# Altium schematic sheet MIXR Regulators - Regulators.SchDoc: Title
size B; Organization: Midnight Sun Solar Rayce Car Team; Address1: University of Waterloo; Address2: 200 University Ave W; Address3: Waterloo, ON, Canada; Address4: N2L 3E9; Website: www.uwmidsun.com; ProjectName: ProjectName
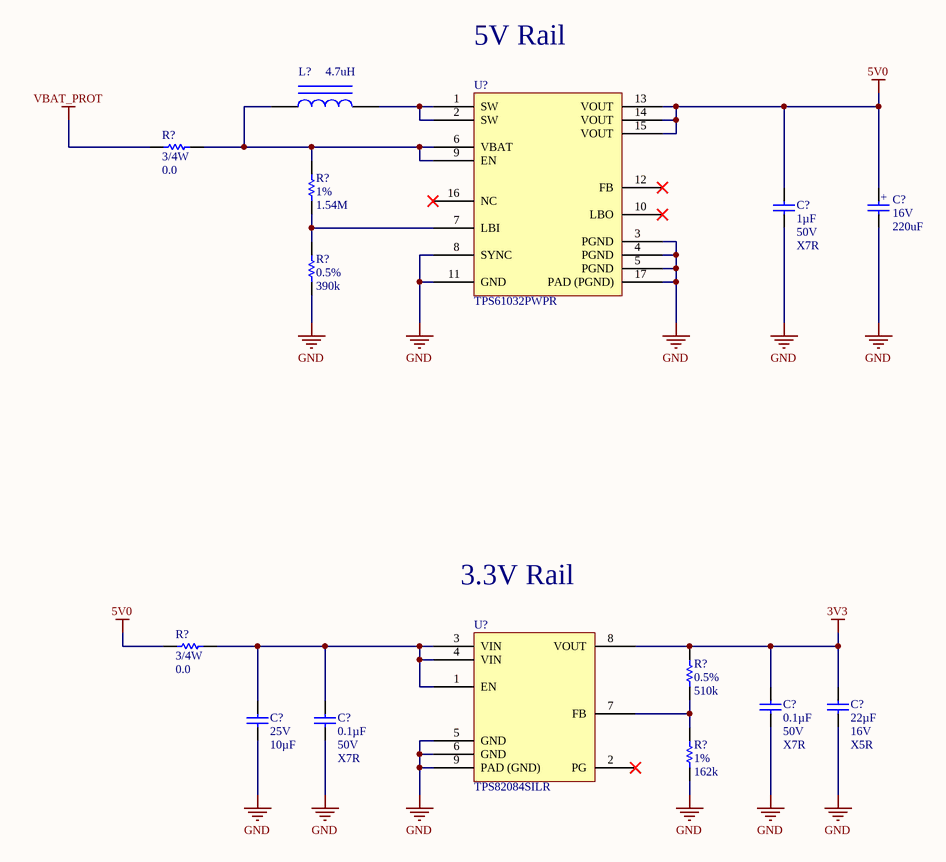
[diagram p0: MIXR Regulators - Regulators.SchDoc]

## Parts
(Parts that share a designator on the sheet are numbered #1, #2 ... from top to bottom, then left to right.)
C?#1  Capacitance: 1µF  Voltage: 50V  Temperature Coefficient: X7R  [CAP, 0603]  (hidden comment: CAP CER 1UF 50V 10% X7R 0603)
C?#2  Voltage: 16V  Capacitance: 220uF  [CAP ALUM 6.3MM RADIAL SMD]  (hidden comment: CAP ALUM 220UF 20% 16V SMD)
C?#3  Capacitance: 0.1µF  Voltage: 50V  Temperature Coefficient: X7R  [CAP, 0603]  (hidden comment: CAP CER 0.1UF 50V 10% X7R 0603)
C?#4  Capacitance: 22µF  Voltage: 16V  Temperature Coefficient: X5R  [CAP, 1210]  (hidden comment: CAP CER 22UF 16V ±20% X5R 1210)
C?#5  Voltage - Rated: 25V  Capacitance: 10µF  [CAP, 0805]  (hidden comment: CAP CER 10uF 25V 10% X5R 0805)
C?#6  Capacitance: 0.1µF  Voltage: 50V  Temperature Coefficient: X7R  [CAP, 0603]  (hidden comment: CAP CER 0.1UF 50V 10% X7R 0603)
L?  Inductance: 4.7uH  [IND 4.7uH 9.4A 10% SMD]  (hidden comment: IND 4.7uH 9.4A 10% SMD)
R?#1  Power (Watts): 3/4W  Resistance: 0.0  [RES 1206]  (hidden comment: RES 0.0 OHM 3/4W 1206)
R?#2  Tolerance: 1%  Resistance: 1.54M  [RES, 0603]  (hidden comment: RES 1.54M OHM 1% 1/10W 0603)
R?#3  Tolerance: 0.5%  Resistance: 390k  [RES, 0603]  (hidden comment: RES 390K OHM 1% 1/10W 0603)
R?#4  Power (Watts): 3/4W  Resistance: 0.0  [RES 1206]  (hidden comment: RES 0.0 OHM 3/4W 1206)
R?#5  Tolerance: 0.5%  Resistance: 510k  [RES, 0603]  (hidden comment: RES 510K OHM 0.5% 1/10W 0603)
R?#6  Tolerance: 1%  Resistance: 162k  [RES, 0603]  (hidden comment: RES 162K OHM 1% 1/10W 0603)
U?#1  Manufacturer Part Number: TPS61032PWPR  [IC REG BOOST 5V 3.6A 16-TSSOP]  (hidden comment: IC REG BOOST 5V 3.6A 16-TSSOP)
U?#2  Manufacturer Part Number: TPS82084SILR  [IC DCDC 0.8-6V 2A 8-uSIP]  (hidden comment: IC DCDC 0.8-6V 2A 8-uSIP)

## Nets
3V3: C?#3.1 C?#4.1 R?#5.1 U?#2.8(VOUT)
5V0: C?#1.1 C?#2.1 R?#4.1 U?#1.13(VOUT) U?#1.14(VOUT) U?#1.15(VOUT)
GND: C?#1.2 C?#2.2 C?#3.2 C?#4.2 C?#5.2 C?#6.2 R?#3.2 R?#6.2 U?#1.3(PGND) U?#1.4(PGND) U?#1.5(PGND) U?#1.8(SYNC) U?#1.11(GND) U?#1.17(PAD_(PGND)) U?#2.5(GND) U?#2.6(GND) U?#2.9(PAD_(GND))
VBAT_PROT: R?#1.1
NetC?#5_1: C?#5.1 C?#6.1 R?#4.2 U?#2.1(EN) U?#2.3(VIN) U?#2.4(VIN)
NetL?_1: L?.1 R?#1.2 R?#2.1 U?#1.6(VBAT) U?#1.9(EN)
NetL?_2: L?.2 U?#1.1(SW) U?#1.2(SW)
NetR?#2_2: R?#2.2 R?#3.1 U?#1.7(LBI)
NetR?#5_2: R?#5.2 R?#6.1 U?#2.7(FB)

Not connected (* = marked no-connect by the designer): U?#1 10(LBO)* 12(FB)* 16(NC)*; U?#2 2(PG)*

## Notes on the sheet
- 5V Rail
- 3.3V Rail
- PROJECT
- DOCUMENT
- DRAWN BY
- LAST MODIFIED
- PART NUMBER
- REVISION
- SHEET
- VARIANT
- OF
- (in symbol CAP ALUM 220UF 20% 16V SMD) +

## Library data of the parts
C?#1 = CAP CER 1UF 50V 10% X7R 0603: 1µF ±10% 50V Ceramic Capacitor X7R 0603 (1608 Metric); Manufacturer 1: Taiyo Yuden; Manufacturer Part Number 1: UMK107AB7105KA-T; Supplier 1: Digi-Key; Supplier Part Number 1: 587-3247-1-ND; Packaging: Cut Tape (CT); Part Status: Active; Operating Temperature: -55°C ~ 125°C; Ratings: -; Mounting Type: Surface Mount, MLCC; Package / Case: 0603 (1608 Metric); Size / Dimension: 0.063" L x 0.031" W (1.60mm x 0.80mm); Height - Seated (Max): -; Thickness (Max): 0.037" (0.95mm); Lead Spacing: -; Lead Style: -; ComponentLink1URL: http://www.yuden.co.jp/productdata/catalog/en/mlcc_all_e.pdf; ComponentLink1Description: http://www.yuden.co.jp/productdata/catalog/en/mlcc_all_e.pdf; Tolerance: ±10%
C?#2 = CAP ALUM 220UF 20% 16V SMD: 220µF 16V Aluminum Electrolytic Capacitors Radial, Can - SMD 2000 Hrs @ 85°C /; Manufacturer: Panasonic; Manufacturer Part Number: EEE-1CA221XAP; Ripple Current: 162mA; Polarity: Polar; Leakage Current: 3uA; Life (Hours): 2000Hour; Dissipation Factor: 0.2%; Supplier 1: Digi-Key; Supplier Part Number 1: PCE4583CT-ND; Stock 1: 3321; Pricing 1: 1 = 0.46000, 10 = 0.32200, 100 = 0.21190 (USD); RoHS: Yes; Mount: Surface Mount; Case/Package: Radial; Number of Pins: 8; Contact Plating: Tin; Min Operating Temperature: -40°C; Max Operating Temperature: 85°C; Tolerance: 20%; Voltage Rating (DC): 16V; Voltage Rating: 16V; Packaging: Tape and Reel; Package Quantity: 900; Ripple Current (AC): 162mA; Termination: SMD/SMT; Diameter: 6.3mm; Length: 8mm; Height: 7.7mm; Height - Seated (Max): 0.303inch; Radiation Hardening: No; REACH SVHC: No SVHC; ComponentLink1URL: https://datasheet.ciiva.com/30258/aba0000ce115-30258470.pdf?src-supplier=Onlinecomponents.com; ComponentLink1Description: https://datasheet.ciiva.com/30258/aba0000ce115-30258470.pdf?src-supplier=Onlinecomponents.com; ComponentLink2URL: https://datasheet.ciiva.com/46378/1790637-46378313.pdf?src-supplier=Element14; ComponentLink2Description: https://datasheet.ciiva.com/46378/1790637-46378313.pdf?src-supplier=Element14; ComponentLink3URL: https://datasheet.ciiva.com/2985/aba0000ce115-2985082.pdf?src-supplier=Avnet; ComponentLink3Description: https://datasheet.ciiva.com/2985/aba0000ce115-2985082.pdf?src-supplier=Avnet; ComponentLink4URL: https://datasheet.ciiva.com/2985/aba0000ce115-2985083.pdf?src-supplier=Avnet; ComponentLink4Description: https://datasheet.ciiva.com/2985/aba0000ce115-2985083.pdf?src-supplier=Avnet; ComponentLink5URL: https://datasheet.ciiva.com/43470/1790637-43470636.pdf?src-supplier=Farnell; ComponentLink5Description: https://datasheet.ciiva.com/43470/1790637-43470636.pdf?src-supplier=Farnell; ComponentLink6URL: https://datasheet.ciiva.com/17530/aba0000ce115-17530127.pdf?src-supplier=Avnet+Europe; ComponentLink6Description: https://datasheet.ciiva.com/17530/aba0000ce115-17530127.pdf?src-supplier=Avnet+Europe; ComponentLink7URL: https://datasheet.ciiva.com/46374/1790637-46374335.pdf?src-supplier=Element14; ComponentLink7Description: https://datasheet.ciiva.com/46374/1790637-46374335.pdf?src-supplier=Element14
C?#3 C?#6 = CAP CER 0.1UF 50V 10% X7R 0603: 0.10µF ±10% 50V Ceramic Capacitor X7R 0603 (1608 Metric); Manufacturer 1: AVX Corporation; Manufacturer Part Number 1: 06035C104KAT2A; Supplier 1: Digi-Key; Supplier Part Number 1: 478-5052-1-ND; Packaging: Cut Tape (CT); Part Status: Active; Operating Temperature: -55°C ~ 125°C; Ratings: -; Mounting Type: Surface Mount, MLCC; Package / Case: 0603 (1608 Metric); Size / Dimension: 0.063" L x 0.032" W (1.60mm x 0.81mm); Height - Seated (Max): -; Thickness (Max): 0.035" (0.90mm); Lead Spacing: -; Lead Style: -; ComponentLink1URL: http://datasheets.avx.com/X7RDielectric.pdf; ComponentLink1Description: http://datasheets.avx.com/X7RDielectric.pdf; Tolerance: ±10%
C?#4 = CAP CER 22UF 16V ±20% X5R 1210: 22µF ±20% 16V Ceramic Capacitor X5R 1210 (3225 Metric); Manufacturer 1: Murata Electronics North America; Manufacturer Part Number 1: GRM32ER61C226ME20L; Supplier 1: Digi-Key; Supplier Part Number 1: 490-1881-1-ND; Packaging: Cut Tape (CT); Part Status: Active; Operating Temperature: -55°C ~ 85°C; Ratings: -; Mounting Type: Surface Mount, MLCC; Package / Case: 1210 (3225 Metric); Size / Dimension: 0.126" L x 0.098" W (3.20mm x 2.50mm); Height - Seated (Max): -; Thickness (Max): 0.106" (2.70mm); Lead Spacing: -; Lead Style: -; ComponentLink1URL: http://www.murata.com/~/media/webrenewal/support/library/catalog/products/capacitor/mlcc/c02e.ashx; ComponentLink1Description: http://www.murata.com/~/media/webrenewal/support/library/catalog/products/capacitor/mlcc/c02e.ashx; Tolerance: ±20%
C?#5 = CAP CER 10uF 25V 10% X5R 0805: 10µF ±10% 25V Ceramic Capacitor X5R 0805 (2012 Metric); Manufacturer: Murata Electronics North America; Manufacturer Part Number: GRM21BR61E106KA73L; Supplier 1: Digi-Key; RoHS: RoHS Compliant; Category: Capacitors; Stock 1: 1695157; Packaging: Cut Tape (CT); Part Status: Active; Tolerance: ±10%; Temperature Coefficient: X5R; Operating Temperature: -55°C ~ 85°C; Features: -; Ratings: -; Applications: General Purpose; Mounting Type: Surface Mount, MLCC; Package / Case: 0805 (2012 Metric); Size / Dimension: 0.079" L x 0.049" W (2.00mm x 1.25mm); Height - Seated (Max): -; Thickness (Max): 0.053" (1.35mm); Lead Spacing: -; Lead Style: -; ComponentLink1URL: http://search.murata.co.jp/Ceramy/image/img/A01X/G101/ENG/GRM21BR61E106KA73-01.pdf; ComponentLink1Description: http://search.murata.co.jp/Ceramy/image/img/A01X/G101/ENG/GRM21BR61E106KA73-01.pdf; Supplier Part Number 1: 490-5523-1-ND; Pricing 1: 1=0.3, 10=0.214, 100=0.1008, 500=0.07068, 1000=0.05851 (CAD)
L? = IND 4.7uH 9.4A 10% SMD: Fixed Inductors SER1360 High Current 4.7 uH 10 % 9.4 A; Manufacturer: Coilcraft; Manufacturer Part Number: SER1360-472KLB; Core Material: Ferrite; Self Resonant Frequency: 32MHz; Shielding: Shielded; DC Resistance (DCR): 6.05mR; Test Frequency: 100kHz; Supplier 1: Mouser; Supplier Part Number 1: 994-SER1360-472KLB; Stock 1: 2176; Pricing 1: 1 = 2.07000, 10 = 1.85000, 50 = 1.66000, 100 = 1.48000, 1000 = 1.07000, 10000 = 0.99800 (USD); RoHS: Yes; Min Operating Temperature: -40°C; Max Operating Temperature: 85°C; Packaging: Cut Tape; Tolerance: 10%; Termination: SMD/SMT; Length: 13mm; Height: 5.8mm; Width: 12.9mm; Lead Free: Contains Lead; ComponentLink1URL: http://www.mouser.com/ds/2/597/ser1360-270713.pdf?src-supplier=Mouser; ComponentLink1Description: http://www.mouser.com/ds/2/597/ser1360-270713.pdf?src-supplier=Mouser; Max DC Current: 9.4A
R?#1 R?#4 = RES 0.0 OHM 3/4W 1206: 0 Ohms Jumper 0.75W, 3/4W Chip Resistor 1206 (3216 Metric) Automotive AEC-Q200 Metal Foil; Manufacturer: Stackpole Electronics Inc.; Manufacturer Part Number: HCJ1206ZT0R00; Supplier 1: Digi-Key; RoHS: RoHS Compliant; Category: Resistors; Stock 1: 1029426; Pricing 1: 1=0.82, 10=0.583, 25=0.4552, 50=0.3852, 100=0.3034, 250=0.25676, 500=0.21006, 1000=0.16337 (CAD); Packaging: Cut Tape (CT); Part Status: Active; Tolerance: Jumper; Composition: Metal Foil; Features: Automotive AEC-Q200; Temperature Coefficient: -; Operating Temperature: -55°C ~ 155°C; Package / Case: 1206 (3216 Metric); Supplier Device Package: 1206; Size / Dimension: 0.122" L x 0.061" W (3.10mm x 1.55mm); Height - Seated (Max): 0.032" (0.80mm); Failure Rate: -; ComponentLink1URL: https://www.seielect.com/catalog/SEI-HCJ.pdf; ComponentLink1Description: https://www.seielect.com/catalog/SEI-HCJ.pdf; Supplier Part Number 1: HCJ1206ZT0R00CT-ND
R?#2 = RES 1.54M OHM 1% 1/10W 0603: Manufacturer: Vishay; Manufacturer Part Number: CRCW06031M54FKEA; Power Rating: 100mW; Voltage Rating: 75V; Temperature Coefficient: 100ppm/°C; Supplier 1: Digi-Key; Supplier Part Number 1: 541-1.54MHCT-ND; Stock 1: 7311; Pricing 1: 1 = 0.10000, 10 = 0.04000, 100 = 0.01620, 1000 = 0.00729, 2500 = 0.00633 (USD); RoHS: Yes; Case/Package: 0603; Number of Pins: 2; Weight: 7.1E-05oz; Case Code (Imperial): 0603; Case Code (Metric): 1608; Contact Plating: Tin; Min Operating Temperature: -55°C; Max Operating Temperature: 155°C; Packaging: Tape and Reel; Package Quantity: 10; Termination: SMD/SMT; Composition: Thick Film; Number of Terminations: 2; Military Standard: Not; Max Power Dissipation: 100mW; Features: Automotive AEC-Q200; Length: 1.55mm; Height: 0.02inch; Width: 0.85mm; Depth: 0.85mm; Radiation Hardening: No; REACH SVHC: Unknown; Lead Free: Lead Free; ComponentLink1URL: https://datasheet.ciiva.com/7670/1697337-7670550.pdf?src-supplier=Element14; ComponentLink1Description: https://datasheet.ciiva.com/7670/1697337-7670550.pdf?src-supplier=Element14; ComponentLink2URL: https://datasheet.ciiva.com/7670/1697337-7670551.pdf?src-supplier=Element14; ComponentLink2Description: https://datasheet.ciiva.com/7670/1697337-7670551.pdf?src-supplier=Element14; ComponentLink3URL: https://datasheet.ciiva.com/5585/dcrcwe3-109170-5585144.pdf?src-supplier=Mouser; ComponentLink3Description: https://datasheet.ciiva.com/5585/dcrcwe3-109170-5585144.pdf?src-supplier=Mouser; ComponentLink4URL: https://datasheet.ciiva.com/22676/1700796-22676058.pdf?src-supplier=Element14; ComponentLink4Description: https://datasheet.ciiva.com/22676/1700796-22676058.pdf?src-supplier=Element14; ComponentLink5URL: https://datasheet.ciiva.com/22676/1847332-22676059.pdf?src-supplier=Element14; ComponentLink5Description: https://datasheet.ciiva.com/22676/1847332-22676059.pdf?src-supplier=Element14; ComponentLink6URL: https://datasheet.ciiva.com/2513/dcrcwe3-2513692.pdf?src-supplier=Digi-Key; ComponentLink6Description: https://datasheet.ciiva.com/2513/dcrcwe3-2513692.pdf?src-supplier=Digi-Key; ComponentLink7URL: https://datasheet.ciiva.com/2513/dcrcwe3-2513693.pdf?src-supplier=Digi-Key; ComponentLink7Description: https://datasheet.ciiva.com/2513/dcrcwe3-2513693.pdf?src-supplier=Digi-Key; ComponentLink8URL: https://datasheet.ciiva.com/2513/dcrcwe3-2513694.pdf?src-supplier=Digi-Key; ComponentLink8Description: https://datasheet.ciiva.com/2513/dcrcwe3-2513694.pdf?src-supplier=Digi-Key; Voltage Rating (DC): 75V
R?#3 = RES 390K OHM 1% 1/10W 0603: 390 kOhms ±0.5% 0.1W, 1/10W Chip Resistor 0603 (1608 Metric) Thin Film /; Manufacturer: Yageo; Manufacturer Part Number: RT0603DRE07390KL; Max Power Dissipation: 100mW; Temperature Coefficient: 50ppm/°C; Supplier 1: Digi-Key; Supplier Part Number 1: 311-2555-1-ND; Stock 1: 4470; Pricing 1: 1 = 0.13000, 10 = 0.11900, 100 = 0.04580, 1000 = 0.02014, 2500 = 0.01740 (USD); RoHS: Yes; Case/Package: 0603; Case Code (Metric): 1608; Case Code (Imperial): 0603; Min Operating Temperature: -55°C; Max Operating Temperature: 155°C; Packaging: Tape and Reel; Composition: Thin Film; Number of Terminations: 2; Features: Moisture Resistant; Length: 0.063inch; Height: 0.022inch; Width: 0.031inch; ComponentLink1URL: http://www.yageo.com/documents/recent/PYu-RT_1-to-0.01_RoHS_L_9.pdf?src-supplier=Digi-Key; ComponentLink1Description: http://www.yageo.com/documents/recent/PYu-RT_1-to-0.01_RoHS_L_9.pdf?src-supplier=Digi-Key
R?#5 = RES 510K OHM 0.5% 1/10W 0603: 510 kOhms ±0.5% 0.1W, 1/10W Chip Resistor 0603 (1608 Metric) Thin Film /; Manufacturer: Yageo; Manufacturer Part Number: RT0603DRE07510KL; Max Power Dissipation: 100mW; Temperature Coefficient: 50ppm/°C; Supplier 1: Digi-Key; Supplier Part Number 1: 311-2610-1-ND; Stock 1: 5404; Pricing 1: 1 = 0.13000, 10 = 0.11900, 100 = 0.04580, 1000 = 0.02014, 2500 = 0.01740 (USD); RoHS: Yes; Case/Package: 0603; Case Code (Metric): 1608; Case Code (Imperial): 0603; Min Operating Temperature: -55°C; Max Operating Temperature: 155°C; Packaging: Tape and Reel; Composition: Thin Film; Number of Terminations: 2; Features: Moisture Resistant; Length: 0.063inch; Height: 0.022inch; Width: 0.031inch; ComponentLink1URL: http://www.yageo.com/documents/recent/PYu-RT_1-to-0.01_RoHS_L_9.pdf?src-supplier=Digi-Key; ComponentLink1Description: http://www.yageo.com/documents/recent/PYu-RT_1-to-0.01_RoHS_L_9.pdf?src-supplier=Digi-Key
R?#6 = RES 162K OHM 1% 1/10W 0603: 162 kOhms ±1% 0.1W, 1/10W Chip Resistor 0603 (1608 Metric) Moisture Resistant Thick Film /; Manufacturer: Yageo; Manufacturer Part Number: RC0603FR-07162KL; Power Rating: 100mW; Temperature Coefficient: 100ppm/°C; Voltage Rating (DC): 50V; Voltage Rating: 75V; Supplier 1: Digi-Key; Supplier Part Number 1: 311-162KHRCT-ND; Stock 1: 328469; Pricing 1: 1 = 0.10000, 10 = 0.02400, 100 = 0.00970, 1000 = 0.00437, 2500 = 0.00379 (USD); RoHS: Yes; Mount: Surface Mount; Case/Package: 0603; Weight: 7.1E-05oz; Case Code (Imperial): 0603; Case Code (Metric): 1608; Min Operating Temperature: -55°C; Max Operating Temperature: 155°C; Packaging: Tape and Reel; Composition: Thick Film; Military Standard: Not; Termination: SMD/SMT; Length: 1.6mm; Height: 0.45mm; Width: 0.8mm; Depth: 0.8mm; Lead Free: Lead Free; ComponentLink1URL: https://datasheet.ciiva.com/11819/0900766b80f96399-11819240.pdf?src-supplier=RSComponents; ComponentLink1Description: https://datasheet.ciiva.com/11819/0900766b80f96399-11819240.pdf?src-supplier=RSComponents
U?#1 = IC REG BOOST 5V 3.6A 16-TSSOP: Boost Switching Regulator IC Positive Fixed 5V 1 Output 3.6A (Switch) 16-PowerTSSOP (0.173", 4.40mm Width); Manufacturer: Texas Instruments; Output Current: 1A; Operating Supply Voltage: 5.5V; Min Input Voltage: 1.8V; Number of Outputs: 1; Efficiency: 96%; Switching Frequency: 600kHz; Synchronous Rectifier: Yes; Quiescent Current: 20uA; Current Rating: 20mA; Supplier 1: Digi-Key; Supplier Part Number 1: 296-14418-1-ND; Stock 1: 5321; Pricing 1: 1 = 2.76000, 10 = 2.48100, 100 = 2.03260, 500 = 1.73032, 1000 = 1.45930 (USD); RoHS: Yes; Mount: Surface Mount; Case/Package: HTSSOP EP; Number of Pins: 16; Weight: 0.002212oz; Min Operating Temperature: -40°C; Max Operating Temperature: 85°C; Output Voltage: 5V; Package Quantity: 1; Max Input Voltage: 5.5V; Packaging: Tape and Reel; Max Output Current: 1A; Nominal Output Voltage: 5V; Min Output Voltage: 5V; Topology: Boost; Output Type: Fixed; Output Configuration: Positive; Width: 4.4mm; Radiation Hardening: No; REACH SVHC: No SVHC; Lead Free: Lead Free; ComponentLink1URL: https://datasheet.ciiva.com/15113/getdatasheetpartid-188303-15113715.pdf?src-supplier=Verical; ComponentLink1Description: https://datasheet.ciiva.com/15113/getdatasheetpartid-188303-15113715.pdf?src-supplier=Verical; ComponentLink2URL: https://datasheet.ciiva.com/26896/tps61032pwpr-26896609.pdf?src-supplier=IIIC; ComponentLink2Description: https://datasheet.ciiva.com/26896/tps61032pwpr-26896609.pdf?src-supplier=IIIC; ComponentLink3URL: https://datasheet.ciiva.com/2026/tps61030-2026195.pdf?src-supplier=Digi-Key; ComponentLink3Description: https://datasheet.ciiva.com/2026/tps61030-2026195.pdf?src-supplier=Digi-Key; ComponentLink4URL: https://datasheet.ciiva.com/2026/tps61030-2026196.pdf?src-supplier=Digi-Key; ComponentLink4Description: https://datasheet.ciiva.com/2026/tps61030-2026196.pdf?src-supplier=Digi-Key; ComponentLink5URL: https://datasheet.ciiva.com/2026/tps61030-2026197.pdf?src-supplier=Digi-Key; ComponentLink5Description: https://datasheet.ciiva.com/2026/tps61030-2026197.pdf?src-supplier=Digi-Key; ComponentLink6URL: https://datasheet.ciiva.com/49118/1864381-49118279.pdf?src-supplier=Element14; ComponentLink6Description: https://datasheet.ciiva.com/49118/1864381-49118279.pdf?src-supplier=Element14
U?#2 = IC DCDC 0.8-6V 2A 8-uSIP: Non-Isolated PoL Module DC DC Converter 1 Output 0.8 ~ 6V 2A 2.5V - 6V Input; Manufacturer: Texas Instruments; Number of Outputs: 1; Min Output Voltage: 800mV; Switching Frequency: 2.4MHz; Synchronous Rectifier: Yes; Efficiency: 95%; Quiescent Current: 17uA; Output Type: Adjustable; Output Configuration: Positive; Supplier 1: Digi-Key; Supplier Part Number 1: 296-46279-1-ND; Stock 1: 31772; Pricing 1: 1 = 3.12000, 10 = 2.80400, 100 = 2.29770, 500 = 1.95602, 1000 = 1.64965 (USD); RoHS: Yes; Mount: Surface Mount; Case/Package: Module; Number of Pins: 8; Min Operating Temperature: -40°C; Max Operating Temperature: 125°C; Packaging: Tape and Reel; Min Input Voltage: 2.5V; Max Input Voltage: 6V; Max Output Voltage: 6V; Output Current: 2A; Output Voltage: 6V; Max Output Current: 2A; Operating Supply Voltage: 6V; Lead Free: Lead Free; ComponentLink1URL: http://www.ti.com/lit/ds/symlink/tps82084.pdf?src-supplier=Digi-Key; ComponentLink1Description: http://www.ti.com/lit/ds/symlink/tps82084.pdf?src-supplier=Digi-Key; ComponentLink2URL: http://www.ti.com/general/docs/lit/getliterature.tsp?genericPartNumber=TPS82084&&fileType=pdf&src-supplier=Avnet; ComponentLink2Description: http://www.ti.com/general/docs/lit/getliterature.tsp?genericPartNumber=TPS82084&&fileType=pdf&src-supplier=Avnet